# Altium schematic sheet 4.ETHERNET.SchDoc: ETHERNET
size A3; SheetNumber: 4; SheetTotal: 16
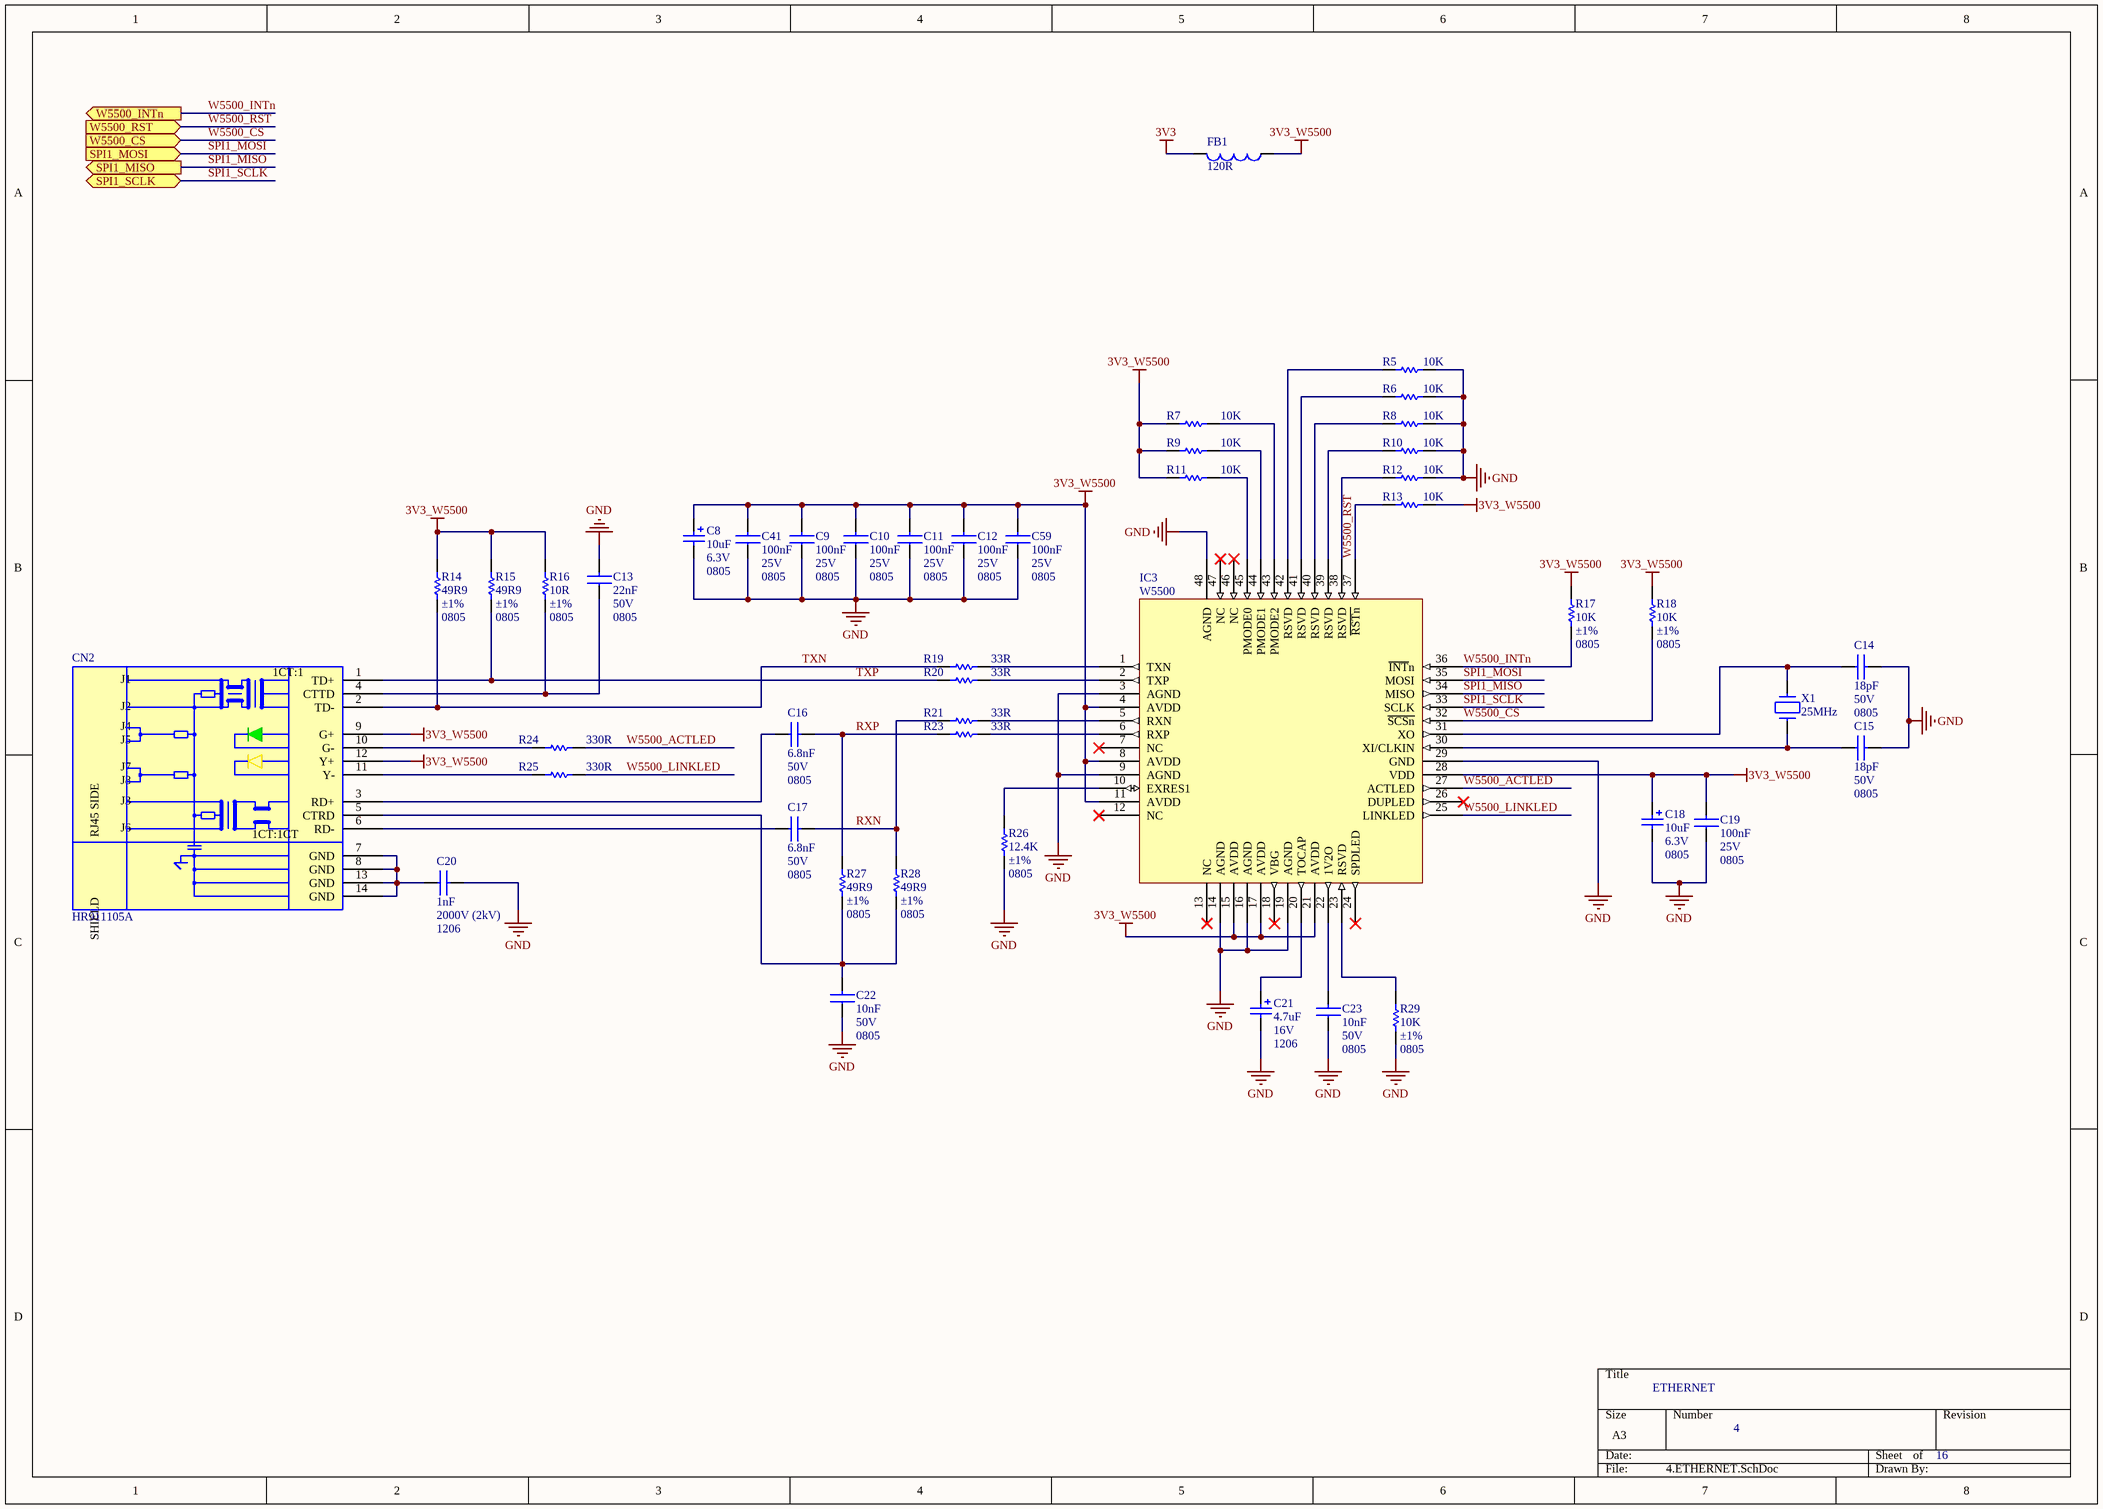
[diagram p0: 4.ETHERNET.SchDoc]

## Parts
C8  value 10uF  Voltage - Rated: 6.3V  Package / Case: 0805  [CAPMP2013X12N_EIA-0805_CASE-R]  (hidden comment: CAP_P)
C9  Capacitance: 100nF  Voltage - Rated: 25V  Package / Case: 0805  [CAPC2012X100N_EIA0805]  (hidden comment: CAP_NP)
C10  Capacitance: 100nF  Voltage - Rated: 25V  Package / Case: 0805  [CAPC2012X100N_EIA0805]  (hidden comment: CAP_NP)
C11  Capacitance: 100nF  Voltage - Rated: 25V  Package / Case: 0805  [CAPC2012X100N_EIA0805]  (hidden comment: CAP_NP)
C12  Capacitance: 100nF  Voltage - Rated: 25V  Package / Case: 0805  [CAPC2012X100N_EIA0805]  (hidden comment: CAP_NP)
C13  Capacitance: 22nF  Voltage - Rated: 50V  Package / Case: 0805  [CAPC2012X100N_EIA0805]  (hidden comment: CAP_NP)
C14  Capacitance: 18pF  Voltage - Rated: 50V  Package / Case: 0805  [CAPC2012X100N_EIA0805]  (hidden comment: CAP_NP)
C15  Capacitance: 18pF  Voltage - Rated: 50V  Package / Case: 0805  [CAPC2012X100N_EIA0805]  (hidden comment: CAP_NP)
C16  Capacitance: 6.8nF  Voltage - Rated: 50V  Package / Case: 0805  [CAPC2012X100N_EIA0805]  (hidden comment: CAP_NP)
C17  Capacitance: 6.8nF  Voltage - Rated: 50V  Package / Case: 0805  [CAPC2012X100N_EIA0805]  (hidden comment: CAP_NP)
C18  value 10uF  Voltage - Rated: 6.3V  Package / Case: 0805  [CAPMP2013X12N_EIA-0805_CASE-R]  (hidden comment: CAP_P)
C19  Capacitance: 100nF  Voltage - Rated: 25V  Package / Case: 0805  [CAPC2012X100N_EIA0805]  (hidden comment: CAP_NP)
C20  value 1nF  Voltage - Rated: 2000V (2kV)  Package / Case: 1206  [CAPC3216X125N_EIA1206]  (hidden comment: CAP_NP)
C21  value 4.7uF  Voltage - Rated: 16V  Package / Case: 1206  [CAPMP3216X16N_EIA-1206_CASE-A]  (hidden comment: CAP_P)
C22  Capacitance: 10nF  Voltage - Rated: 50V  Package / Case: 0805  [CAPC2012X100N_EIA0805]  (hidden comment: CAP_NP)
C23  Capacitance: 10nF  Voltage - Rated: 50V  Package / Case: 0805  [CAPC2012X100N_EIA0805]  (hidden comment: CAP_NP)
C41  Capacitance: 100nF  Voltage - Rated: 25V  Package / Case: 0805  [CAPC2012X100N_EIA0805]  (hidden comment: CAP_NP)
C59  Capacitance: 100nF  Voltage - Rated: 25V  Package / Case: 0805  [CAPC2012X100N_EIA0805]  (hidden comment: CAP_NP)
CN2  HR911105A  [HANRUN_HR911105A]
FB1  Impedance: 120R  [FILC2012X100N_EIA0805]  (hidden comment: BEAD)
IC3  W5500  [QFP50P900X900X160-48N]
R5  value 10K  [RESC2013X65N_EIA0805]  (hidden comment: RES)
R6  value 10K  [RESC2013X65N_EIA0805]  (hidden comment: RES)
R7  value 10K  [RESC2013X65N_EIA0805]  (hidden comment: RES)
R8  value 10K  [RESC2013X65N_EIA0805]  (hidden comment: RES)
R9  value 10K  [RESC2013X65N_EIA0805]  (hidden comment: RES)
R10  value 10K  [RESC2013X65N_EIA0805]  (hidden comment: RES)
R11  value 10K  [RESC2013X65N_EIA0805]  (hidden comment: RES)
R12  value 10K  [RESC2013X65N_EIA0805]  (hidden comment: RES)
R13  value 10K  [RESC2013X65N_EIA0805]  (hidden comment: RES)
R14  value 49R9  Tolerance: ±1%  Package / Case: 0805  [RESC2013X65N_EIA0805]  (hidden comment: RES)
R15  value 49R9  Tolerance: ±1%  Package / Case: 0805  [RESC2013X65N_EIA0805]  (hidden comment: RES)
R16  value 10R  Tolerance: ±1%  Package / Case: 0805  [RESC2013X65N_EIA0805]  (hidden comment: RES)
R17  value 10K  Tolerance: ±1%  Package / Case: 0805  [RESC2013X65N_EIA0805]  (hidden comment: RES)
R18  value 10K  Tolerance: ±1%  Package / Case: 0805  [RESC2013X65N_EIA0805]  (hidden comment: RES)
R19  value 33R  [RESC2013X65N_EIA0805]  (hidden comment: RES)
R20  value 33R  [RESC2013X65N_EIA0805]  (hidden comment: RES)
R21  value 33R  [RESC2013X65N_EIA0805]  (hidden comment: RES)
R23  value 33R  [RESC2013X65N_EIA0805]  (hidden comment: RES)
R24  value 330R  [RESC2013X65N_EIA0805]  (hidden comment: RES)
R25  value 330R  [RESC2013X65N_EIA0805]  (hidden comment: RES)
R26  value 12.4K  Tolerance: ±1%  Package / Case: 0805  [RESC2013X65N_EIA0805]  (hidden comment: RES)
R27  value 49R9  Tolerance: ±1%  Package / Case: 0805  [RESC2013X65N_EIA0805]  (hidden comment: RES)
R28  value 49R9  Tolerance: ±1%  Package / Case: 0805  [RESC2013X65N_EIA0805]  (hidden comment: RES)
R29  value 10K  Tolerance: ±1%  Package / Case: 0805  [RESC2013X65N_EIA0805]  (hidden comment: RES)
X1  value 25MHz  [HC-49/US]  (hidden comment: CRYSTAL)

## Ports
SPI1_MISO (out), SPI1_MOSI (in), SPI1_SCLK (bidir), W5500_CS (in), W5500_INTn (out), W5500_RST (in)

## Nets
3V3: FB1.2
3V3_W5500: C8.1 C9.2 C10.2 C11.2 C12.2 C18.1 C19.2 C41.2 C59.2 CN2.9(G+) CN2.12(Y+) FB1.1 IC3.4(AVDD) IC3.8(AVDD) IC3.11(AVDD) IC3.15(AVDD) IC3.17(AVDD) IC3.21(AVDD) IC3.28(VDD) R7.2 R9.2 R11.2 R13.2 R14.1 R15.1 R16.1 R17.1 R18.1
GND: C8.2 C9.1 C10.1 C11.1 C12.1 C13.2 C14.2 C15.2 C18.2 C19.1 C20.2 C21.2 C22.1 C23.1 C41.1 C59.1 IC3.3(AGND) IC3.9(AGND) IC3.14(AGND) IC3.16(AGND) IC3.19(AGND) IC3.29(GND) IC3.48(AGND) R5.2 R6.2 R8.2 R10.2 R12.2 R26.2 R29.2
RXN: C17.2 R21.2 R28.1
RXP: C16.2 R23.2 R27.1
SPI1_MISO: IC3.34(MISO) ; port SPI1_MISO
SPI1_MOSI: IC3.35(MOSI) ; port SPI1_MOSI
SPI1_SCLK: IC3.33(SCLK) ; port SPI1_SCLK
TXN: CN2.2(TD-) R14.2 R19.2
TXP: CN2.1(TD+) R15.2 R20.2
W5500_ACTLED: IC3.27(ACTLED) R24.1
W5500_CS: IC3.32(~{SCSn}) R18.2 ; port W5500_CS
W5500_INTn: IC3.36(~{INT}n) R17.2 ; port W5500_INTn
W5500_LINKLED: IC3.25(LINKLED) R25.1
W5500_RST: IC3.37(~{RSTn}) R13.1 ; port W5500_RST
NetC13_1: C13.1 CN2.4(CTTD) R16.2
NetC14_1: C14.1 IC3.31(XO) X1.1
NetC15_1: C15.1 IC3.30(XI/CLKIN) X1.2
NetC16_1: C16.1 CN2.3(RD+)
NetC17_1: C17.1 CN2.6(RD-)
NetC20_1: C20.1 CN2.7(GND) CN2.8(GND) CN2.13(GND) CN2.14(GND)
NetC21_1: C21.1 IC3.20(TOCAP)
NetC22_2: C22.2 CN2.5(CTRD) R27.2 R28.2
NetC23_2: C23.2 IC3.22(1V2O)
NetCN2_10: CN2.10(G-) R24.2
NetCN2_11: CN2.11(Y-) R25.2
NetIC3_1: IC3.1(TXN) R19.1
NetIC3_2: IC3.2(TXP) R20.1
NetIC3_5: IC3.5(RXN) R21.1
NetIC3_6: IC3.6(RXP) R23.1
NetIC3_10: IC3.10(EXRES1) R26.1
NetIC3_23: IC3.23(RSVD) R29.1
NetIC3_38: IC3.38(RSVD) R12.1
NetIC3_39: IC3.39(RSVD) R10.1
NetIC3_40: IC3.40(RSVD) R8.1
NetIC3_41: IC3.41(RSVD) R6.1
NetIC3_42: IC3.42(RSVD) R5.1
NetIC3_43: IC3.43(PMODE2) R7.1
NetIC3_44: IC3.44(PMODE1) R9.1
NetIC3_45: IC3.45(PMODE0) R11.1

Not connected (* = marked no-connect by the designer): IC3 7(NC)* 12(NC)* 13(NC)* 18(VBG)* 24(SPDLED)* 26(DUPLED)* 46(NC)* 47(NC)*

## Notes on the sheet
- (in symbol SCON00127) 1CT:1; J1; J2; J4; J5; J7; RJ45 SIDE; J8; J3; J6; 1CT:1CT; SHIELD

## Library data of the parts
C8 C18 = SCAP01400004: CAP TANT 10UF 6.3V 10% 0805; Manufacturer: AVX Corporation; Manufacturer Part Number: TPSP106K006R1500; Capacitance: 10µF; ESR (Equivalent Series Resistance): 6 Ohm; Type: Molded; Cost x1 ($): 0.83; Cost x10 ($): 0.79600; Cost x100 ($): 0.38610; Cost x1000 ($): 0.26730; Distrubutor: Digikey; Part Number: SCAP01400004; Tolerance: ±10%; Operating Temperature: -55°C ~ 125°C; Category: Capacitors; Family: Tantalum Capacitors; Distributor Part Number: 478-9266-1-ND; Distributor Link: http://www.digikey.com/product-detail/en/TPSR106K006R1500/478-9266-1-ND/4562131; ROHS: YES; Quantity: 20
C9-C12 C19 C41 C59 = SCAP00300093: CAP CER 0.1UF 25V X7R 0805; Manufacturer: Samsung Electro-Mechanics America, Inc.; Manufacturer Part Number: CL21B104KACNNNC; Value: 100nF; Tolerance: ±10%; Type: Multi Layer Ceramic Capacitor  (MLCC); Cost x1 ($): 0.10000; Cost x10 ($): 0.03300; Cost x100 ($): 0.01470; Cost x1000 ($): 0.00825; Distrubutor: Digikey; Lead Time: 11 Weeks; Part Number: SCAP00300093; Temperature Coefficient: X7R; Operating Temperature: -55°C ~ 125°C; Mounting Type: Surface Mount, MLCC; Size / Dimension: 0.079" L x 0.049" W (2.00mm x 1.25mm); Category: Capacitors; Family: Ceramic Capacitors; Distributor Part Number: 1276-1099-1-ND; Distributor Link: http://www.digikey.com/product-detail/en/samsung-electro-mechanics-america-inc/CL21B104KACNNNC/1276-1099-1-ND/3889185; ROHS: YES; Moisture Sensitivity Level (MSL): 1 (Unlimited); Quantity: 50
C13 = SCAP00300087: CAP CER 0.022UF 50V X7R 0805; Manufacturer: Samsung Electro-Mechanics America, Inc.; Manufacturer Part Number: CL21B223KBANNNC; Value: 22nF; Tolerance: ±10%; Type: Multi Layer Ceramic Capacitor  (MLCC); Cost x1 ($): 0.10000; Cost x10 ($): 0.05800; Cost x100 ($): 0.02600; Cost x1000 ($): 0.01458; Distrubutor: Digikey; Lead Time: 11 Weeks; Part Number: SCAP00300087; Temperature Coefficient: X7R; Operating Temperature: -55°C ~ 125°C; Mounting Type: Surface Mount, MLCC; Size / Dimension: 0.079" L x 0.049" W (2.00mm x 1.25mm); Category: Capacitors; Family: Ceramic Capacitors; Distributor Part Number: 1276-1081-1-ND; Distributor Link: http://www.digikey.com/product-detail/en/samsung-electro-mechanics-america-inc/CL21B223KBANNNC/1276-1081-1-ND/3889167; ROHS: YES; Moisture Sensitivity Level (MSL): 1 (Unlimited); Quantity: 50
C14 C15 = SCAP00300040: CAP CER 18PF 50V NP0 0805; Manufacturer: Samsung Electro-Mechanics America, Inc.; Manufacturer Part Number: CL21C180JBANNNC; Tolerance: ±5%; Temperature Coefficient: C0G, NP0; Type: Multi Layer Ceramic Capacitor  (MLCC); Cost x1 ($): 0.10000; Cost x10 ($): 0.04400; Cost x100 ($): 0.01960; Cost x1000 ($): 0.01100; Distrubutor: Digikey; Lead Time: 11 Weeks; Part Number: SCAP00300040; Value: 18pF; Operating Temperature: -55°C ~ 125°C; Mounting Type: Surface Mount, MLCC; Size / Dimension: 0.079" L x 0.049" W (2.00mm x 1.25mm); Category: Capacitors; Family: Ceramic Capacitors; Distributor Part Number: 1276-1107-1-ND; Distributor Link: http://www.digikey.com/product-detail/en/samsung-electro-mechanics-america-inc/CL21C180JBANNNC/1276-1107-1-ND/3889193; ROHS: YES; Moisture Sensitivity Level (MSL): 1 (Unlimited); Quantity: 50
C16 C17 = SCAP00300083: CAP CER 6800PF 50V X7R 0805; Manufacturer: Samsung Electro-Mechanics America, Inc.; Manufacturer Part Number: CL21B682KBANNNC; Value: 6.8nF; Tolerance: ±10%; Type: Multi Layer Ceramic Capacitor  (MLCC); Cost x1 ($): 0.10000; Cost x10 ($): 0.05100; Cost x100 ($): 0.02280; Cost x1000 ($): 0.01279; Distrubutor: Digikey; Lead Time: 11 Weeks; Part Number: SCAP00300083; Temperature Coefficient: X7R; Operating Temperature: -55°C ~ 125°C; Mounting Type: Surface Mount, MLCC; Size / Dimension: 0.079" L x 0.049" W (2.00mm x 1.25mm); Category: Capacitors; Family: Ceramic Capacitors; Distributor Part Number: 1276-1799-1-ND; Distributor Link: http://www.digikey.com/product-detail/en/samsung-electro-mechanics-america-inc/CL21B682KBANNNC/1276-1799-1-ND/3889885; ROHS: YES; Moisture Sensitivity Level (MSL): 1 (Unlimited); Quantity: 50
C20 = SCAP00410036: CAP CER 1000PF 2KV X7R 1206; Manufacturer: Johanson Dielectrics Inc.; Manufacturer Part Number: 202R18W102KV4E; Tolerance: ±10%; Type: Multi Layer Ceramic Capacitor  (MLCC); Cost x1 ($): 0.12000; Cost x10 ($): 0.08600; Cost x100 ($): 0.04070; Cost x1000 ($): 0.02361; Distrubutor: Digikey; Lead Time: 8 Weeks; Part Number: SCAP00410036; Capacitance: 1000pF; Temperature Coefficient: X7R; Operating Temperature: -55°C ~ 125°C; Mounting Type: Surface Mount, MLCC; Size / Dimension: 0.125" L x 0.062" W (3.17mm x 1.57mm); Category: Capacitors; Family: Ceramic Capacitors; Distributor Part Number: 709-1036-1-ND; Distributor Link: http://www.digikey.com/product-detail/en/johanson-dielectrics-inc/202R18W102KV4E/709-1036-1-ND/1556441; ROHS: YES; Moisture Sensitivity Level (MSL): 1 (Unlimited); Quantity: 0
C21 = SCAP01400003: CAP TANT 4.7UF 16V 10% 1206; Manufacturer: AVX Corporation; Manufacturer Part Number: TAJA475K016RNJ; Capacitance: 4.7µF; ESR (Equivalent Series Resistance): 4 Ohm; Type: Molded; Cost x1 ($): 0.56000; Cost x10 ($): 0.53600; Cost x100 ($): 0.26000; Cost x1000 ($): 0.18000; Distrubutor: Digikey; Part Number: SCAP01400003; Tolerance: ±10%; Operating Temperature: -55°C ~ 125°C; Category: Capacitors; Family: Tantalum Capacitors; Distributor Part Number: 478-3868-1-ND; Distributor Link: http://www.digikey.com/product-detail/en/TAJA475K016RNJ/478-3868-1-ND/1126914; ROHS: YES; Quantity: 20
C22 C23 = SCAP00300085: CAP CER 10000PF 50V X7R 0805; Manufacturer: Samsung Electro-Mechanics America, Inc.; Manufacturer Part Number: CL21B103KBANNNC; Value: 10nF; Tolerance: ±10%; Type: Multi Layer Ceramic Capacitor  (MLCC); Cost x1 ($): 0.10000; Cost x10 ($): 0.02700; Cost x100 ($): 0.01210; Cost x1000 ($): 0.00677; Distrubutor: Digikey; Lead Time: 11 Weeks; Part Number: SCAP00300085; Temperature Coefficient: X7R; Operating Temperature: -55°C ~ 125°C; Mounting Type: Surface Mount, MLCC; Size / Dimension: 0.079" L x 0.049" W (2.00mm x 1.25mm); Category: Capacitors; Family: Ceramic Capacitors; Distributor Part Number: 1276-1015-1-ND; Distributor Link: http://www.digikey.com/product-detail/en/samsung-electro-mechanics-america-inc/CL21B103KBANNNC/1276-1015-1-ND/3889101; ROHS: YES; Moisture Sensitivity Level (MSL): 1 (Unlimited); Quantity: 50
CN2 = SCON00127: CONN MAGJACK 1PORT 100 BASE-T; Connector Type: RJ45; Distrubutor: Digikey; Part Number: SCON00127; Value: HR911105A; Category: Connectors, Interconnects; Family: Modular Connectors - Jacks With Magnetics; Mounting Type: Through Hole; Quantity: 10
FB1 = SFIL00005: FERRITE CHIP POWER 120 OHM SMD; Manufacturer: Laird-Signal Integrity Products; Manufacturer Part Number: HI0805O121R-10; Type: Differential Mode - Single; Current Rating: 3.5A; DC Resistance (DCR): 20 mOhm Max; Cost x10 ($): 0.08700; Cost x100 ($): 0.05230; Cost x1000 ($): 0.03010; Distrubutor: Digikey; Cost x1 ($): 0.10000; Part Number: SFIL00005; Package / Case: 0805 (2012 Metric); Value: BEAD; Category: Filters; Family: Ferrite Beads and Chips; Distributor Part Number: 240-2393-1-ND; ROHS: YES; Datasheet Link: http://www.digikey.com/product-detail/en/HI0805O121R-10/240-2393-1-ND/806753; Quantity: 50
IC3 = SIC00138: IC CTLR 3-1 ETH TCP/IP 48LQFP; Manufacturer: WIZnet; Vin: 2.97 V ~ 3.63 V; Protocol: SPI; Iin: 132mA; Cost x10 ($): 3.72500; Cost x100 ($): 3.05450; Cost x1000 ($): 2.08600; Distrubutor: Digikey; Lead Time: 8 Weeks; Cost x1 ($): 4.17000; Part Number: SIC00138; Manufacturer Part Number: W5500; Value: W5500; Operating Temperature: -40°C ~ 85°C; Category: Integrated Circuits (ICs); Family: Interface - Controllers; Package / Case: 48-LQFP (7x7); Type: Ethernet; Distributor Part Number: 1278-1021-ND; ROHS: YES; Distributor Link: http://www.digikey.com/product-detail/en/wiznet/W5500/1278-1021-ND/4425702; MSL: 3 (168 Hours); Quantity: 0
R5-R13 R17 R18 R29 = SRES03010098: RES SMD 10K OHM 1% 1/8W 0805; Manufacturer: Yageo; Manufacturer Part Number: RC0805FR-0710KL; Power (Watts): 0.125W, 1/8W; Cost x1 ($): 0.10; Cost x10 ($): 0.21; Cost x100 ($): 0.84; Cost x1000 ($): 3.79; Distrubutor: Digikey; Part Number: SRES03010098; Resistance (Ohm): 10K; Category: Resistors; Family: Chip Resistor - Surface Mount; Distributor Part Number: 311-10.0KCRCT-ND; Distributor Link: http://www.digikey.com/product-detail/en/RC0805FR-0710KL/311-10.0KCRCT-ND/730482; ROHS: YES; Quantity: 0
  R5-R13: Tolerance: ±1%; Package / Case: 0805
R14 R15 R27 R28 = SRES03030081: RES SMD 49.9 OHM 1% 1/8W 0805; Manufacturer: Samsung Electro-Mechanics America, Inc.; Manufacturer Part Number: RC2012F49R9CS; Resistance (Ohm): 49.9; Power (Watts): 0.125W, 1/8W; Cost x1 ($): 0.10000; Cost x10 ($): 0.02200; Cost x100 ($): 0.00910; Cost x1000 ($): 0.00408; Distrubutor: Digikey; Part Number: SRES03030081; Category: Resistors; Family: Chip Resistor - Surface Mount; Distributor Part Number: 1276-5210-1-ND; Distributor Link: http://www.digikey.com/product-detail/en/samsung-electro-mechanics-america-inc/RC2012F49R9CS/1276-5210-1-ND/3968182; ROHS: YES; Quantity: 0
R16 = SRES03010026: RES SMD 10 OHM 1% 1/8W 0805; Manufacturer: Yageo; Manufacturer Part Number: RC0805FR-0710RL; Resistance (Ohm): 10; Power (Watts): 0.125W, 1/8W; Cost x1 ($): 0.10; Cost x10 ($): 0.21; Cost x100 ($): 0.84; Cost x1000 ($): 3.79; Distrubutor: Digikey; Part Number: SRES03010026; Category: Resistors; Family: Chip Resistor - Surface Mount; Distributor Part Number: 311-10.0CRCT-ND; Distributor Link: http://www.digikey.com/product-detail/en/RC0805FR-0710RL/311-10.0CRCT-ND/730481; ROHS: YES; Quantity: 0
R19-R21 R23 = SRES03010038: RES SMD 33 OHM 1% 1/8W 0805; Manufacturer: Yageo; Manufacturer Part Number: RC0805FR-0733RL; Resistance (Ohm): 33; Power (Watts): 0.125W, 1/8W; Cost x1 ($): 0.10; Cost x10 ($): 0.21; Cost x100 ($): 0.84; Cost x1000 ($): 3.79; Distrubutor: Digikey; Part Number: SRES03010038; Tolerance: ±1%; Package / Case: 0805; Category: Resistors; Family: Chip Resistor - Surface Mount; Distributor Part Number: 311-33.0CRCT-ND; Distributor Link: http://www.digikey.com/product-detail/en/RC0805FR-0733RL/311-33.0CRCT-ND/730809; ROHS: YES; Quantity: 0
R24 R25 = SRES03010062: RES SMD 330 OHM 1% 1/8W 0805; Manufacturer: Yageo; Manufacturer Part Number: RC0805FR-07330RL; Resistance (Ohm): 330; Power (Watts): 0.125W, 1/8W; Cost x1 ($): 0.10; Cost x10 ($): 0.21; Cost x100 ($): 0.84; Cost x1000 ($): 3.79; Distrubutor: Digikey; Part Number: SRES03010062; Tolerance: ±1%; Package / Case: 0805; Category: Resistors; Family: Chip Resistor - Surface Mount; Distributor Part Number: 311-330CRCT-ND; Distributor Link: http://www.digikey.com/product-detail/en/RC0805FR-07330RL/311-330CRCT-ND/730813; ROHS: YES; Quantity: 0
R26 = SRES03010171: RES SMD 12.4K OHM 1% 1/8W 0805; Manufacturer: Yageo; Manufacturer Part Number: RC0805FR-0712K4L; Power (Watts): 0.125W, 1/8W; Cost x1 ($): 0.10000; Cost x10 ($): 0.02100; Cost x100 ($): 0.00840; Cost x1000 ($): 0.00379; Distrubutor: Digikey; Lead Time: 22 Weeks; Part Number: SRES03010171; Resistance (Ohm): 12.4K; Category: Resistors; Family: Chip Resistor - Surface Mount; Distributor Part Number: 311-12.4KCRCT-ND; Distributor Link: http://www.digikey.com/product-detail/en/yageo/RC0805FR-0712K4L/311-12.4KCRCT-ND/730519; ROHS: YES; Moisture Sensitivity Level (MSL): 1 (Unlimited); Quantity: 0
X1 = SCRY00016: CRYSTAL 25.0000MHZ 18PF T/H; Manufacturer: CTS-Frequency Controls; Manufacturer Part Number: ATS250B-E; Frequency Tolerance: ±30ppm; ESR: 30 Ohm; Cost x10 ($): 0.30000; Cost x100 ($): 0.24000; Cost x1000 ($): 0.19200; Distrubutor: Digikey; Lead Time: 6 Weeks; Cost x1 ($): 0.36000; Part Number: SCRY00016; Mounting Type: Through Hole; Load Capacitance: 18pF; Package / Case: HC49/US; Type: MHz Crystal; Distributor Part Number: CTX928-ND; ROHS: YES; Datasheet Link: http://www.digikey.com/product-detail/en/cts-frequency-controls/ATS250B-E/CTX928-ND/2292924; Quantity: 20